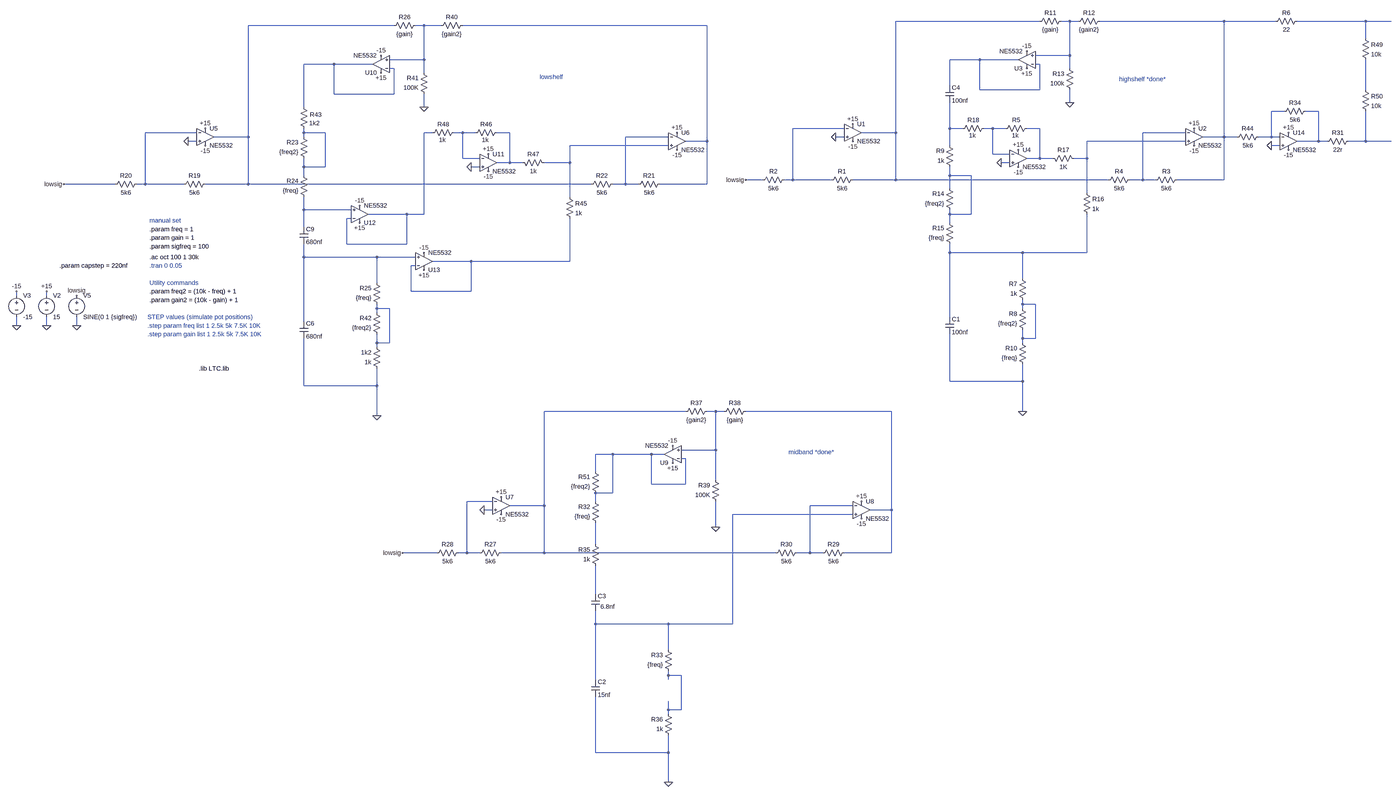
[diagram p0: schematic EQ band.asc, whole sheet]
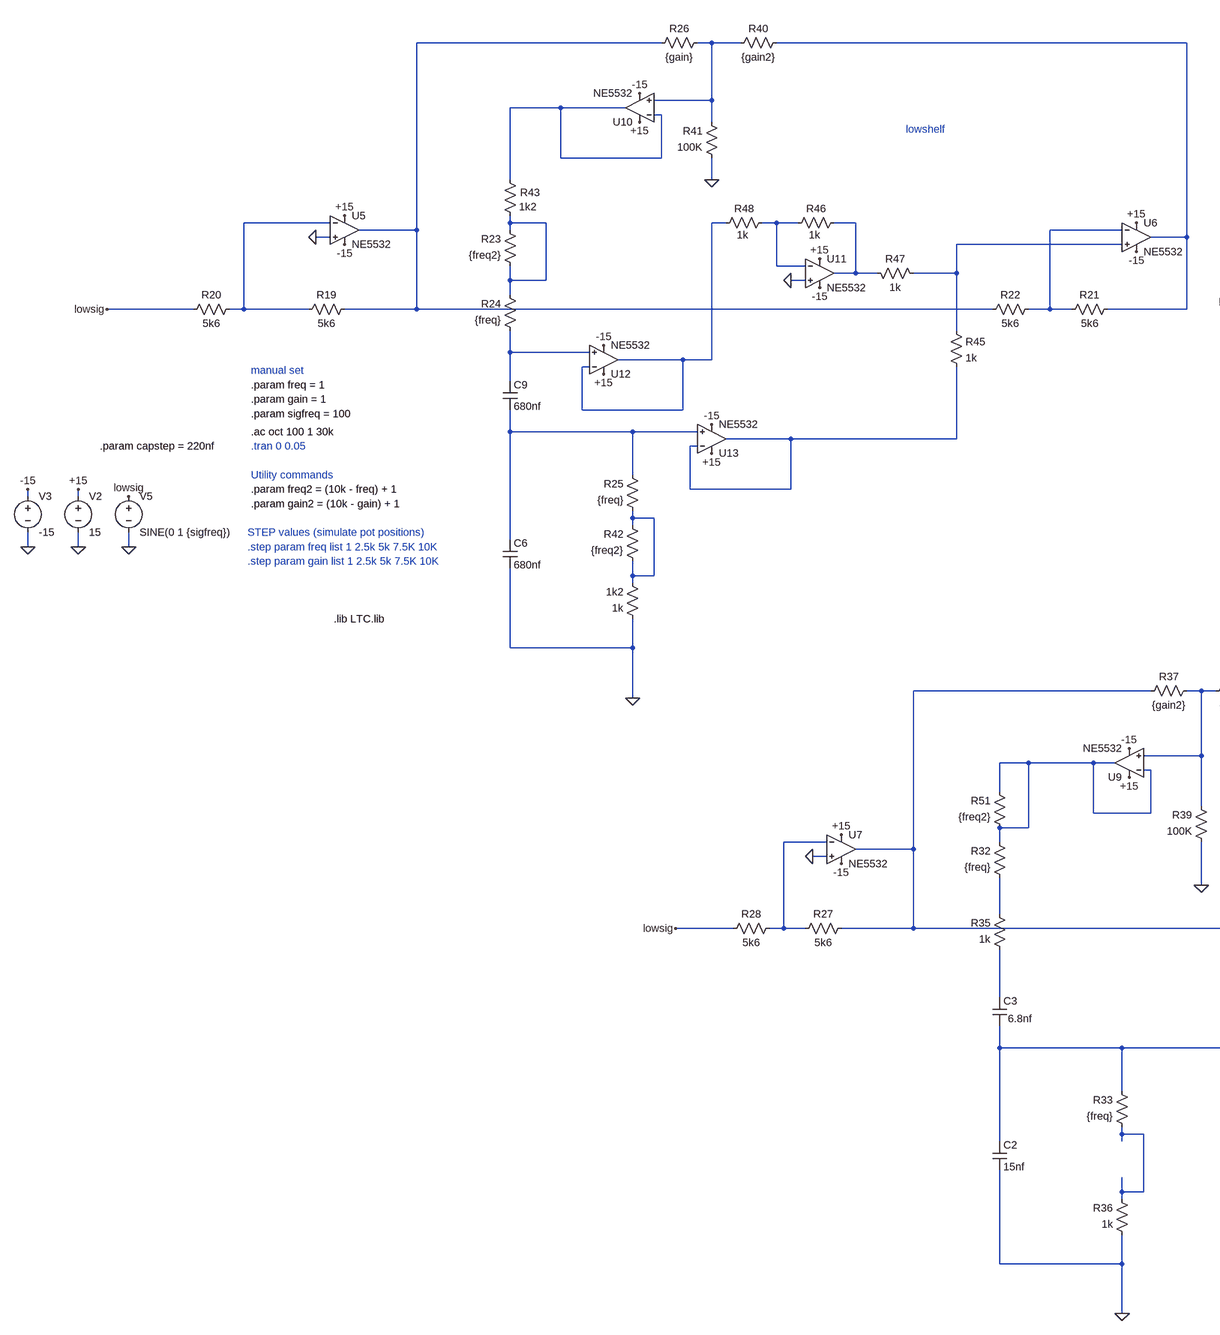
[diagram p1: schematic EQ band.asc, part, row 1 of 1, column 1 of 2]
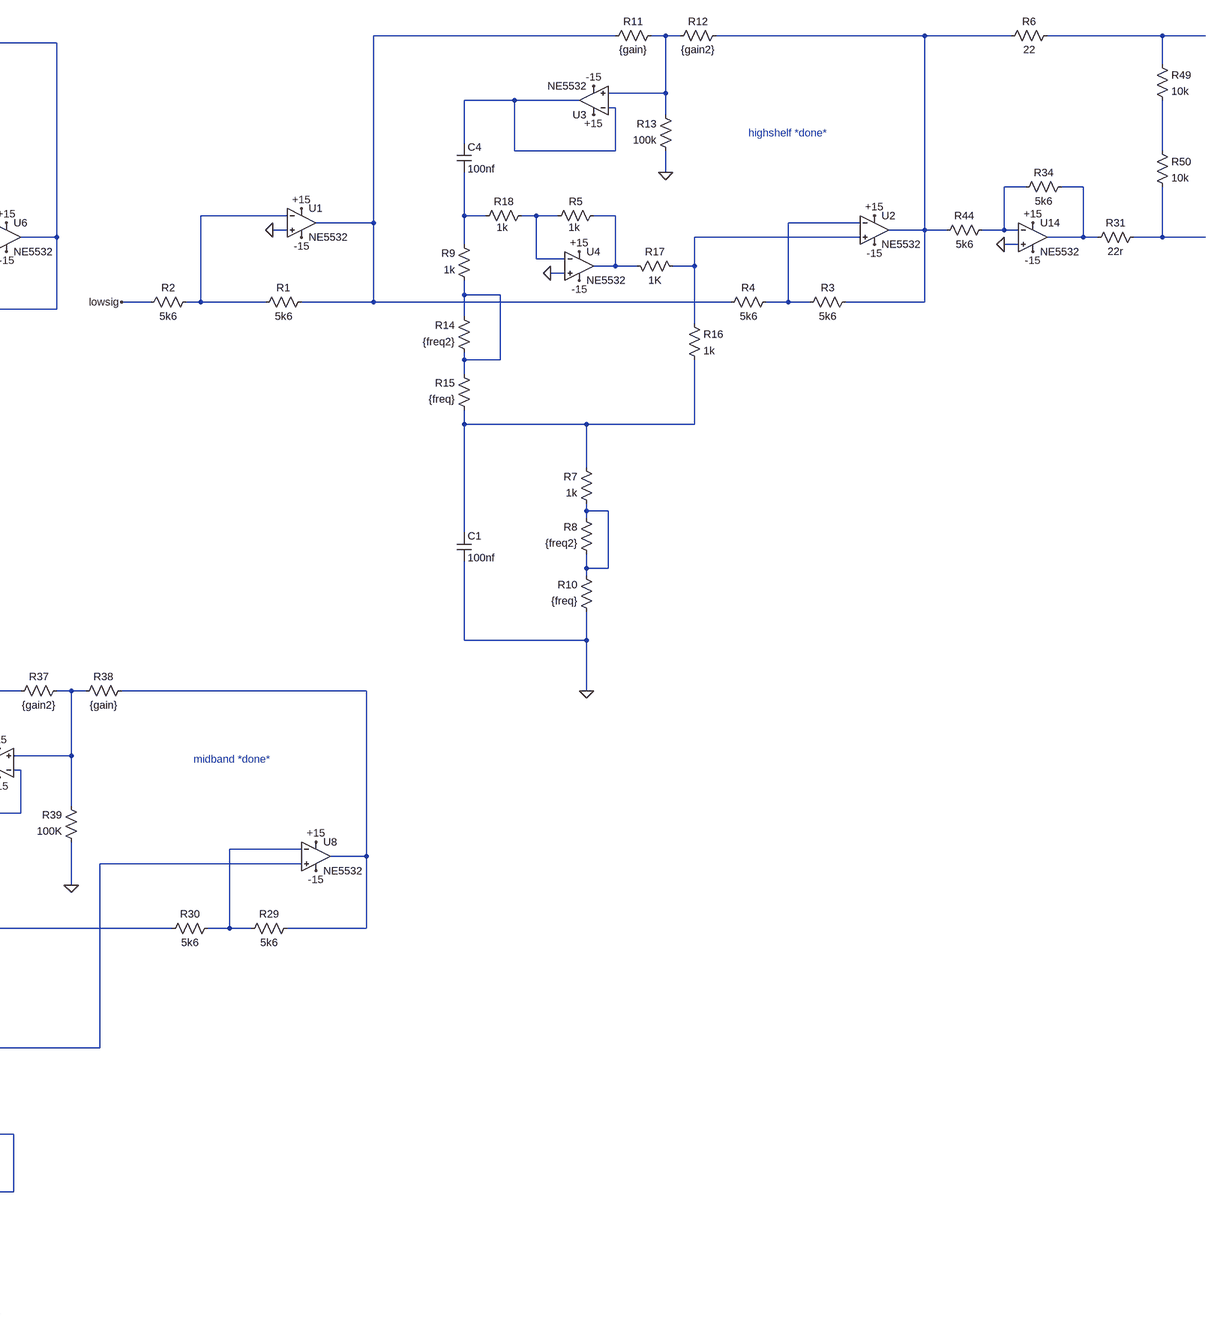
[diagram p2: schematic EQ band.asc, part, row 1 of 1, column 2 of 2]
EQ band.asc, the LTspice schematic file:
Version 4
SHEET 1 11860 6880
WIRE 8112 1488 7568 1488
WIRE 8224 1488 8192 1488
WIRE 8256 1488 8224 1488
WIRE 8800 1488 8336 1488
WIRE 8992 1488 8800 1488
WIRE 9328 1488 9072 1488
WIRE 9424 1488 9328 1488
WIRE 5696 1504 5152 1504
WIRE 5808 1504 5776 1504
WIRE 5872 1504 5808 1504
WIRE 6864 1504 5952 1504
WIRE 9328 1552 9328 1488
WIRE 8224 1616 8224 1488
WIRE 8224 1616 8096 1616
WIRE 5808 1632 5808 1504
WIRE 5808 1632 5680 1632
WIRE 7888 1632 7776 1632
WIRE 8032 1632 7888 1632
WIRE 5472 1648 5360 1648
WIRE 5616 1648 5472 1648
WIRE 8112 1648 8096 1648
WIRE 5696 1664 5680 1664
WIRE 8224 1664 8224 1616
WIRE 5808 1680 5808 1632
WIRE 7776 1728 7776 1632
WIRE 7888 1744 7888 1632
WIRE 8112 1744 8112 1648
WIRE 8112 1744 7888 1744
WIRE 9328 1744 9328 1632
WIRE 5472 1760 5472 1648
WIRE 5696 1760 5696 1664
WIRE 5696 1760 5472 1760
WIRE 8224 1792 8224 1744
WIRE 5360 1808 5360 1648
WIRE 5808 1808 5808 1760
WIRE 9024 1824 8976 1824
WIRE 9152 1824 9104 1824
WIRE 7376 1888 7184 1888
WIRE 7776 1888 7776 1792
WIRE 7824 1888 7776 1888
WIRE 7936 1888 7904 1888
WIRE 7984 1888 7936 1888
WIRE 8112 1888 8064 1888
WIRE 4960 1904 4768 1904
WIRE 5360 1904 5360 1888
WIRE 5440 1904 5360 1904
WIRE 5840 1904 5808 1904
WIRE 5952 1904 5920 1904
WIRE 6000 1904 5952 1904
WIRE 6128 1904 6080 1904
WIRE 7568 1904 7568 1488
WIRE 7568 1904 7440 1904
WIRE 8656 1904 8496 1904
WIRE 5152 1920 5152 1504
WIRE 5152 1920 5024 1920
WIRE 5360 1920 5360 1904
WIRE 6720 1920 6560 1920
WIRE 7376 1920 7344 1920
WIRE 8800 1920 8800 1488
WIRE 8800 1920 8720 1920
WIRE 8848 1920 8800 1920
WIRE 8976 1920 8976 1824
WIRE 8976 1920 8928 1920
WIRE 9008 1920 8976 1920
WIRE 4960 1936 4928 1936
WIRE 6864 1936 6864 1504
WIRE 6864 1936 6784 1936
WIRE 8656 1936 8288 1936
WIRE 9152 1936 9152 1824
WIRE 9152 1936 9072 1936
WIRE 9184 1936 9152 1936
WIRE 9328 1936 9328 1824
WIRE 9328 1936 9264 1936
WIRE 9424 1936 9328 1936
WIRE 6720 1952 6352 1952
WIRE 7776 1952 7776 1888
WIRE 9008 1952 8976 1952
WIRE 7936 1984 7936 1888
WIRE 8000 1984 7936 1984
WIRE 5952 2000 5952 1904
WIRE 6016 2000 5952 2000
WIRE 8112 2000 8112 1888
WIRE 8112 2000 8064 2000
WIRE 8160 2000 8112 2000
WIRE 8288 2000 8288 1936
WIRE 8288 2000 8240 2000
WIRE 6128 2016 6128 1904
WIRE 6128 2016 6080 2016
WIRE 6176 2016 6128 2016
WIRE 6352 2016 6352 1952
WIRE 6352 2016 6256 2016
WIRE 8000 2016 7968 2016
WIRE 5360 2032 5360 2000
WIRE 5440 2032 5440 1904
WIRE 5440 2032 5360 2032
WIRE 6016 2032 5984 2032
WIRE 5360 2064 5360 2032
WIRE 7776 2064 7776 2032
WIRE 7856 2064 7776 2064
WIRE 7072 2080 7008 2080
WIRE 7184 2080 7184 1888
WIRE 7184 2080 7152 2080
WIRE 7328 2080 7184 2080
WIRE 7568 2080 7568 1904
WIRE 7568 2080 7408 2080
WIRE 8368 2080 7568 2080
WIRE 8496 2080 8496 1904
WIRE 8496 2080 8448 2080
WIRE 8544 2080 8496 2080
WIRE 8800 2080 8800 1920
WIRE 8800 2080 8624 2080
WIRE 4656 2096 4464 2096
WIRE 4768 2096 4768 1904
WIRE 4768 2096 4736 2096
WIRE 4912 2096 4768 2096
WIRE 5152 2096 5152 1920
WIRE 5152 2096 4992 2096
WIRE 6432 2096 5152 2096
WIRE 6560 2096 6560 1920
WIRE 6560 2096 6512 2096
WIRE 6608 2096 6560 2096
WIRE 6864 2096 6864 1936
WIRE 6864 2096 6688 2096
WIRE 7776 2112 7776 2064
WIRE 8288 2128 8288 2000
WIRE 6352 2144 6352 2016
WIRE 5360 2192 5360 2144
WIRE 5536 2192 5360 2192
WIRE 5744 2208 5600 2208
WIRE 5808 2208 5808 1904
WIRE 5808 2208 5744 2208
WIRE 7776 2208 7776 2192
WIRE 7856 2208 7856 2064
WIRE 7856 2208 7776 2208
WIRE 5536 2224 5520 2224
WIRE 7776 2240 7776 2208
WIRE 5360 2256 5360 2192
WIRE 5520 2320 5520 2224
WIRE 5744 2320 5744 2208
WIRE 5744 2320 5520 2320
WIRE 7776 2352 7776 2320
WIRE 8048 2352 7776 2352
WIRE 8288 2352 8288 2208
WIRE 8288 2352 8048 2352
WIRE 5360 2368 5360 2320
WIRE 5632 2368 5360 2368
WIRE 5776 2368 5632 2368
WIRE 5984 2384 5840 2384
WIRE 6352 2384 6352 2224
WIRE 6352 2384 5984 2384
WIRE 5776 2400 5760 2400
WIRE 8048 2448 8048 2352
WIRE 5632 2464 5632 2368
WIRE 5760 2496 5760 2400
WIRE 5984 2496 5984 2384
WIRE 5984 2496 5760 2496
WIRE 4288 2512 4288 2496
WIRE 4400 2512 4400 2496
WIRE 8048 2544 8048 2528
WIRE 8096 2544 8048 2544
WIRE 5632 2560 5632 2544
WIRE 5680 2560 5632 2560
WIRE 8048 2560 8048 2544
WIRE 5632 2576 5632 2560
WIRE 7776 2592 7776 2352
WIRE 5360 2608 5360 2368
WIRE 4288 2624 4288 2592
WIRE 4400 2624 4400 2592
WIRE 4512 2624 4512 2592
WIRE 8048 2672 8048 2640
WIRE 8096 2672 8096 2544
WIRE 8096 2672 8048 2672
WIRE 5632 2688 5632 2656
WIRE 5680 2688 5680 2560
WIRE 5680 2688 5632 2688
WIRE 8048 2688 8048 2672
WIRE 5632 2704 5632 2688
WIRE 7776 2832 7776 2656
WIRE 8048 2832 8048 2768
WIRE 8048 2832 7776 2832
WIRE 5360 2848 5360 2672
WIRE 5632 2848 5632 2784
WIRE 5632 2848 5360 2848
WIRE 6784 2944 6256 2944
WIRE 6896 2944 6864 2944
WIRE 6928 2944 6896 2944
WIRE 7552 2944 7008 2944
WIRE 8048 2944 8048 2832
WIRE 5632 2960 5632 2848
WIRE 6896 3088 6896 2944
WIRE 6896 3088 6768 3088
WIRE 6512 3104 6448 3104
WIRE 6656 3104 6512 3104
WIRE 6704 3104 6656 3104
WIRE 6784 3120 6768 3120
WIRE 6448 3168 6448 3104
WIRE 6896 3200 6896 3088
WIRE 6656 3216 6656 3104
WIRE 6784 3216 6784 3120
WIRE 6784 3216 6656 3216
WIRE 6512 3248 6512 3104
WIRE 6512 3248 6448 3248
WIRE 6064 3280 5968 3280
WIRE 6448 3280 6448 3248
WIRE 6256 3296 6256 2944
WIRE 6256 3296 6128 3296
WIRE 7408 3296 7248 3296
WIRE 6064 3312 6032 3312
WIRE 7552 3312 7552 2944
WIRE 7552 3312 7472 3312
WIRE 7408 3328 6960 3328
WIRE 6896 3376 6896 3280
WIRE 6448 3440 6448 3360
WIRE 5856 3472 5728 3472
WIRE 5968 3472 5968 3280
WIRE 5968 3472 5936 3472
WIRE 6016 3472 5968 3472
WIRE 6256 3472 6256 3296
WIRE 6256 3472 6096 3472
WIRE 7120 3472 6256 3472
WIRE 7248 3472 7248 3296
WIRE 7248 3472 7200 3472
WIRE 7296 3472 7248 3472
WIRE 7552 3472 7552 3312
WIRE 7552 3472 7376 3472
WIRE 6448 3632 6448 3520
WIRE 6448 3744 6448 3696
WIRE 6720 3744 6448 3744
WIRE 6960 3744 6960 3328
WIRE 6960 3744 6720 3744
WIRE 6720 3840 6720 3744
WIRE 6720 3936 6720 3920
WIRE 6768 3936 6720 3936
WIRE 6448 3952 6448 3744
WIRE 6720 3952 6720 3936
WIRE 6720 4064 6720 4032
WIRE 6768 4064 6768 3936
WIRE 6768 4064 6720 4064
WIRE 6720 4080 6720 4064
WIRE 6448 4224 6448 4016
WIRE 6720 4224 6720 4160
WIRE 6720 4224 6448 4224
WIRE 6720 4336 6720 4224
FLAG 4400 2624 0
FLAG 4288 2624 0
FLAG 4288 2496 -15
FLAG 4400 2496 +15
FLAG 6032 3312 0
FLAG 6096 3264 +15
FLAG 6096 3328 -15
FLAG 7440 3280 +15
FLAG 7440 3344 -15
FLAG 6720 4336 0
FLAG 6736 3136 +15
FLAG 6736 3072 -15
FLAG 6896 3376 0
FLAG 4512 2624 0
FLAG 4512 2512 lowsig
FLAG 7344 1920 0
FLAG 7408 1872 +15
FLAG 7408 1936 -15
FLAG 8688 1888 +15
FLAG 8688 1952 -15
FLAG 8048 2944 0
FLAG 8064 1664 +15
FLAG 8064 1600 -15
FLAG 8224 1792 0
FLAG 7968 2016 0
FLAG 8032 1968 +15
FLAG 8032 2032 -15
FLAG 4928 1936 0
FLAG 4992 1888 +15
FLAG 4992 1952 -15
FLAG 6752 1904 +15
FLAG 6752 1968 -15
FLAG 5648 1680 +15
FLAG 5648 1616 -15
FLAG 5808 1808 0
FLAG 5984 2032 0
FLAG 6048 1984 +15
FLAG 6048 2048 -15
FLAG 5568 2240 +15
FLAG 5568 2176 -15
FLAG 5808 2416 +15
FLAG 5808 2352 -15
FLAG 4464 2096 lowsig
FLAG 5632 2960 0
FLAG 9040 1904 +15
FLAG 9040 1968 -15
FLAG 8976 1952 0
FLAG 5728 3472 lowsig
FLAG 7008 2080 lowsig
SYMBOL voltage 4400 2496 R0
SYMATTR InstName V2
SYMATTR Value 15
SYMBOL voltage 4288 2496 R0
SYMATTR InstName V3
SYMATTR Value -15
SYMBOL res 6112 3456 R90
WINDOW 0 0 56 VBottom 2
WINDOW 3 32 56 VTop 2
SYMATTR InstName R27
SYMATTR Value 5k6
SYMBOL res 5952 3456 R90
WINDOW 0 0 56 VBottom 2
WINDOW 3 32 56 VTop 2
SYMATTR InstName R28
SYMATTR Value 5k6
SYMBOL OpAmps/opamp2 6096 3232 R0
SYMATTR InstName U7
SYMATTR Value NE5532
SYMBOL OpAmps/opamp2 7440 3248 R0
SYMATTR InstName U8
SYMATTR Value NE5532
SYMBOL res 7392 3456 R90
WINDOW 0 0 56 VBottom 2
WINDOW 3 32 56 VTop 2
SYMATTR InstName R29
SYMATTR Value 5k6
SYMBOL res 7216 3456 R90
WINDOW 0 0 56 VBottom 2
WINDOW 3 32 56 VTop 2
SYMATTR InstName R30
SYMATTR Value 5k6
SYMBOL res 6464 3376 R180
WINDOW 0 36 76 Left 2
WINDOW 3 36 40 Left 2
SYMATTR InstName R32
SYMATTR Value {freq}
SYMBOL res 6736 3936 R180
WINDOW 0 36 76 Left 2
WINDOW 3 36 40 Left 2
SYMATTR InstName R33
SYMATTR Value {freq}
SYMBOL res 6464 3536 R180
WINDOW 0 36 76 Left 2
WINDOW 3 36 40 Left 2
SYMATTR InstName R35
SYMATTR Value 1k
SYMBOL res 6736 4176 R180
WINDOW 0 36 76 Left 2
WINDOW 3 36 40 Left 2
SYMATTR InstName R36
SYMATTR Value 1k
SYMBOL OpAmps/opamp2 6736 3168 R180
SYMATTR InstName U9
SYMATTR Value NE5532
SYMBOL res 6768 2960 R270
WINDOW 0 32 56 VTop 2
WINDOW 3 0 56 VBottom 2
SYMATTR InstName R37
SYMATTR Value {gain2}
SYMBOL res 6912 2960 R270
WINDOW 0 32 56 VTop 2
WINDOW 3 0 56 VBottom 2
SYMATTR InstName R38
SYMATTR Value {gain}
SYMBOL res 6912 3296 R180
WINDOW 0 36 76 Left 2
WINDOW 3 36 40 Left 2
SYMATTR InstName R39
SYMATTR Value 100K
SYMBOL cap 6432 3952 R0
SYMATTR InstName C2
SYMATTR Value 15nf
SYMBOL cap 6432 3632 R0
WINDOW 3 34 47 Left 2
SYMATTR Value 6.8nf
SYMATTR InstName C3
SYMBOL voltage 4512 2496 R0
SYMATTR InstName V5
SYMATTR Value SINE(0 1 {sigfreq})
SYMATTR Value2 AC 1
SYMBOL res 7424 2064 R90
WINDOW 0 0 56 VBottom 2
WINDOW 3 32 56 VTop 2
SYMATTR InstName R1
SYMATTR Value 5k6
SYMBOL res 7168 2064 R90
WINDOW 0 0 56 VBottom 2
WINDOW 3 32 56 VTop 2
SYMATTR InstName R2
SYMATTR Value 5k6
SYMBOL OpAmps/opamp2 7408 1840 R0
SYMATTR InstName U1
SYMATTR Value NE5532
SYMBOL OpAmps/opamp2 8688 1856 R0
SYMATTR InstName U2
SYMATTR Value NE5532
SYMBOL res 8640 2064 R90
WINDOW 0 0 56 VBottom 2
WINDOW 3 32 56 VTop 2
SYMATTR InstName R3
SYMATTR Value 5k6
SYMBOL res 8464 2064 R90
WINDOW 0 0 56 VBottom 2
WINDOW 3 32 56 VTop 2
SYMATTR InstName R4
SYMATTR Value 5k6
SYMBOL res 8064 2544 R180
WINDOW 0 36 76 Left 2
WINDOW 3 36 40 Left 2
SYMATTR InstName R7
SYMATTR Value 1k
SYMBOL res 8064 2656 R180
WINDOW 0 36 76 Left 2
WINDOW 3 36 40 Left 2
SYMATTR InstName R8
SYMATTR Value {freq2}
SYMBOL res 8064 2784 R180
WINDOW 0 36 76 Left 2
WINDOW 3 36 40 Left 2
SYMATTR InstName R10
SYMATTR Value {freq}
SYMBOL OpAmps/opamp2 8064 1696 R180
SYMATTR InstName U3
SYMATTR Value NE5532
SYMBOL res 8096 1504 R270
WINDOW 0 32 56 VTop 2
WINDOW 3 0 56 VBottom 2
SYMATTR InstName R11
SYMATTR Value {gain}
SYMBOL res 8240 1504 R270
WINDOW 0 32 56 VTop 2
WINDOW 3 0 56 VBottom 2
SYMATTR InstName R12
SYMATTR Value {gain2}
SYMBOL res 8240 1760 R180
WINDOW 0 36 76 Left 2
WINDOW 3 36 40 Left 2
SYMATTR InstName R13
SYMATTR Value 100k
SYMBOL cap 7760 1728 R0
SYMATTR InstName C4
SYMATTR Value 100nf
SYMBOL res 7792 2048 R180
WINDOW 0 36 76 Left 2
WINDOW 3 36 40 Left 2
SYMATTR InstName R9
SYMATTR Value 1k
SYMBOL res 7792 2208 R180
WINDOW 0 36 76 Left 2
WINDOW 3 36 40 Left 2
SYMATTR InstName R14
SYMATTR Value {freq2}
SYMBOL res 7792 2336 R180
WINDOW 0 36 76 Left 2
WINDOW 3 36 40 Left 2
SYMATTR InstName R15
SYMATTR Value {freq}
SYMBOL cap 7760 2592 R0
SYMATTR InstName C1
SYMATTR Value 100nf
SYMBOL res 8272 2112 R0
SYMATTR InstName R16
SYMATTR Value 1k
SYMBOL OpAmps/opamp2 8032 1936 R0
SYMATTR InstName U4
SYMATTR Value NE5532
SYMBOL res 8080 1872 R90
WINDOW 0 0 56 VBottom 2
WINDOW 3 27 59 VTop 2
SYMATTR InstName R5
SYMATTR Value 1k
SYMBOL res 8256 2016 M270
WINDOW 0 32 56 VTop 2
WINDOW 3 0 56 VBottom 2
SYMATTR InstName R17
SYMATTR Value 1K
SYMBOL res 7920 1872 R90
WINDOW 0 0 56 VBottom 2
WINDOW 3 27 59 VTop 2
SYMATTR InstName R18
SYMATTR Value 1k
SYMBOL res 5008 2080 R90
WINDOW 0 0 56 VBottom 2
WINDOW 3 32 56 VTop 2
SYMATTR InstName R19
SYMATTR Value 5k6
SYMBOL res 4752 2080 R90
WINDOW 0 0 56 VBottom 2
WINDOW 3 32 56 VTop 2
SYMATTR InstName R20
SYMATTR Value 5k6
SYMBOL OpAmps/opamp2 4992 1856 R0
SYMATTR InstName U5
SYMATTR Value NE5532
SYMBOL OpAmps/opamp2 6752 1872 R0
SYMATTR InstName U6
SYMATTR Value NE5532
SYMBOL res 6704 2080 R90
WINDOW 0 0 56 VBottom 2
WINDOW 3 32 56 VTop 2
SYMATTR InstName R21
SYMATTR Value 5k6
SYMBOL res 6528 2080 R90
WINDOW 0 0 56 VBottom 2
WINDOW 3 32 56 VTop 2
SYMATTR InstName R22
SYMATTR Value 5k6
SYMBOL OpAmps/opamp2 5648 1712 R180
SYMATTR InstName U10
SYMATTR Value NE5532
SYMBOL res 5680 1520 R270
WINDOW 0 32 56 VTop 2
WINDOW 3 0 56 VBottom 2
SYMATTR InstName R26
SYMATTR Value {gain}
SYMBOL res 5856 1520 R270
WINDOW 0 32 56 VTop 2
WINDOW 3 0 56 VBottom 2
SYMATTR InstName R40
SYMATTR Value {gain2}
SYMBOL res 5824 1776 R180
WINDOW 0 36 76 Left 2
WINDOW 3 36 40 Left 2
SYMATTR InstName R41
SYMATTR Value 100K
SYMBOL cap 5344 2608 R0
SYMATTR InstName C6
SYMATTR Value 680nf
SYMBOL res 6336 2128 R0
SYMATTR InstName R45
SYMATTR Value 1k
SYMBOL OpAmps/opamp2 6048 1952 R0
SYMATTR InstName U11
SYMATTR Value NE5532
SYMBOL res 6096 1888 R90
WINDOW 0 0 56 VBottom 2
WINDOW 3 27 59 VTop 2
SYMATTR InstName R46
SYMATTR Value 1k
SYMBOL res 6272 2032 M270
WINDOW 0 32 56 VTop 2
WINDOW 3 0 56 VBottom 2
SYMATTR InstName R47
SYMATTR Value 1k
SYMBOL res 5936 1888 R90
WINDOW 0 0 56 VBottom 2
WINDOW 3 27 59 VTop 2
SYMATTR InstName R48
SYMATTR Value 1k
SYMBOL OpAmps/opamp2 5568 2272 M180
SYMATTR InstName U12
SYMATTR Value NE5532
SYMBOL OpAmps/opamp2 5808 2448 M180
SYMATTR InstName U13
SYMATTR Value NE5532
SYMBOL res 5376 2016 R180
WINDOW 0 36 76 Left 2
WINDOW 3 36 40 Left 2
SYMATTR InstName R23
SYMATTR Value {freq2}
SYMBOL res 5376 2160 R180
WINDOW 0 36 76 Left 2
WINDOW 3 36 40 Left 2
SYMATTR InstName R24
SYMATTR Value {freq}
SYMBOL res 5344 1792 R0
WINDOW 0 38 45 Left 2
SYMATTR InstName R43
SYMATTR Value 1k2
SYMBOL cap 5344 2256 R0
SYMATTR InstName C9
SYMATTR Value 680nf
SYMBOL res 5648 2560 R180
WINDOW 0 36 76 Left 2
WINDOW 3 36 40 Left 2
SYMATTR InstName R25
SYMATTR Value {freq}
SYMBOL res 5648 2672 R180
WINDOW 0 36 76 Left 2
WINDOW 3 36 40 Left 2
SYMATTR InstName R42
SYMATTR Value {freq2}
SYMBOL res 5648 2800 R180
WINDOW 0 36 76 Left 2
WINDOW 3 36 40 Left 2
SYMATTR InstName 1k2
SYMATTR Value 1k
SYMBOL Res 8976 1504 R270
WINDOW 0 32 56 VTop 2
WINDOW 3 0 56 VBottom 2
SYMATTR InstName R6
SYMATTR Value 22
SYMBOL OpAmps/opamp2 9040 1872 R0
SYMATTR InstName U14
SYMATTR Value NE5532
SYMBOL Res 9280 1920 R90
WINDOW 0 0 56 VBottom 2
WINDOW 3 32 56 VTop 2
SYMATTR InstName R31
SYMATTR Value 22r
SYMBOL Res 9120 1808 R90
WINDOW 0 0 56 VBottom 2
WINDOW 3 32 56 VTop 2
SYMATTR InstName R34
SYMATTR Value 5k6
SYMBOL Res 8944 1904 R90
WINDOW 0 0 56 VBottom 2
WINDOW 3 32 56 VTop 2
SYMATTR InstName R44
SYMATTR Value 5k6
SYMBOL Res 9312 1536 R0
SYMATTR InstName R49
SYMATTR Value 10k
SYMBOL Res 9312 1728 R0
SYMATTR InstName R50
SYMATTR Value 10k
SYMBOL res 6464 3264 R180
WINDOW 0 36 76 Left 2
WINDOW 3 36 40 Left 2
SYMATTR InstName R51
SYMATTR Value {freq2}
TEXT 4784 2368 Left 2 !.ac oct 100 1 30k
TEXT 4968 2784 Left 2 !.lib LTC.lib
TEXT 7168 3096 Left 2 ;midband *done*
TEXT 4784 2400 Left 2 ;.tran 0 0.05
TEXT 4784 2496 Left 2 !.param freq2 = (10k - freq) + 1
TEXT 4776 2624 Left 2 ;.step param freq list 1 2.5k 5k 7.5K 10K
TEXT 4784 2264 Left 2 !.param freq = 1
TEXT 4784 2232 Left 2 ;manual set
TEXT 4776 2592 Left 2 ;STEP values (simulate pot positions)
TEXT 4784 2296 Left 2 !.param gain = 1
TEXT 4776 2656 Left 2 ;.step param gain list 1 2.5k 5k 7.5K 10K
TEXT 4784 2528 Left 2 !.param gain2 = (10k - gain) + 1
TEXT 8408 1704 Left 2 ;highshelf *done*
TEXT 6240 1696 Left 2 ;lowshelf
TEXT 4784 2328 Left 2 !.param sigfreq = 100
TEXT 4784 2464 Left 2 ;Utility commands
TEXT 4448 2400 Left 2 !.param capstep = 220nf

The netlist it stands for:
* EQ band.asc
V2 +15 0 15
V3 -15 0 -15
R27 N034 N038 5k6
R28 N038 lowsig 5k6
XU7 0 N038 +15 -15 N034 NE5532  ; pins In+ In- V+ V- OUT
XU8 N040 N039 +15 -15 N036 NE5532  ; pins In+ In- V+ V- OUT
R29 N036 N039 5k6
R30 N039 N034 5k6
R32 N041 N037 {freq}
R33 N043 N040 {freq}
R35 N042 N041 1k
R36 0 N043 1k
XU9 N035 N037 +15 -15 N037 NE5532  ; pins In+ In- V+ V- OUT
R37 N034 N035 {gain2}
R38 N035 N036 {gain}
R39 0 N035 100K
C2 N040 0 15nf
C3 N042 N040 6.8nf
V5 lowsig 0 SINE(0 1 {sigfreq}) AC 1
R1 N001 N013 5k6
R2 N013 lowsig 5k6
XU1 0 N013 +15 -15 N001 NE5532  ; pins In+ In- V+ V- OUT
XU2 N024 N022 +15 -15 N003 NE5532  ; pins In+ In- V+ V- OUT
R3 N003 N022 5k6
R4 N022 N001 5k6
R7 N032 N029 1k
R8 N032 N032 {freq2}
R10 0 N032 {freq}
XU3 N002 N008 +15 -15 N008 NE5532  ; pins In+ In- V+ V- OUT
R11 N001 N002 {gain}
R12 N002 N003 {gain2}
R13 0 N002 100k
C4 N008 N014 100nf
R9 N027 N014 1k
R14 N027 N027 {freq2}
R15 N029 N027 {freq}
C1 N029 0 100nf
R16 N024 N029 1k
XU4 0 N015 +15 -15 N016 NE5532  ; pins In+ In- V+ V- OUT
R5 N016 N015 1k
R17 N024 N016 1K
R18 N015 N014 1k
R19 N005 N017 5k6
R20 N017 lowsig 5k6
XU5 0 N017 +15 -15 N005 NE5532  ; pins In+ In- V+ V- OUT
XU6 N026 N023 +15 -15 N007 NE5532  ; pins In+ In- V+ V- OUT
R21 N007 N023 5k6
R22 N023 N005 5k6
XU10 N006 N009 +15 -15 N009 NE5532  ; pins In+ In- V+ V- OUT
R26 N005 N006 {gain}
R40 N006 N007 {gain2}
R41 0 N006 100K
C6 N030 0 680nf
R45 N026 N031 1k
XU11 0 N020 +15 -15 N021 NE5532  ; pins In+ In- V+ V- OUT
R46 N021 N020 1k
R47 N026 N021 1k
R48 N020 N019 1k
XU12 N028 N019 +15 -15 N019 NE5532  ; pins In+ In- V+ V- OUT
XU13 N030 N031 +15 -15 N031 NE5532  ; pins In+ In- V+ V- OUT
R23 N018 N018 {freq2}
R24 N028 N018 {freq}
R43 N009 N018 1k2
C9 N028 N030 680nf
R25 N033 N030 {freq}
R42 N033 N033 {freq2}
R§1k2 0 N033 1k
R6 N003 N004 22
XU14 0 N011 +15 -15 N012 NE5532  ; pins In+ In- V+ V- OUT
R31 N025 N012 22r
R34 N012 N011 5k6
R44 N011 N003 5k6
R49 N004 N010 10k
R50 N010 N025 10k
R51 N037 N037 {freq2}
.ac oct 100 1 30k
.lib LTC.lib
* midband *done*
* .tran 0 0.05
.param freq2 = (10k - freq) + 1
* .step param freq list 1 2.5k 5k 7.5K 10K
.param freq = 1
* manual set
* STEP values (simulate pot positions)
.param gain = 1
* .step param gain list 1 2.5k 5k 7.5K 10K
.param gain2 = (10k - gain) + 1
* highshelf *done*
* lowshelf
.param sigfreq = 100
* Utility commands
.param capstep = 220nf
.backanno
.end